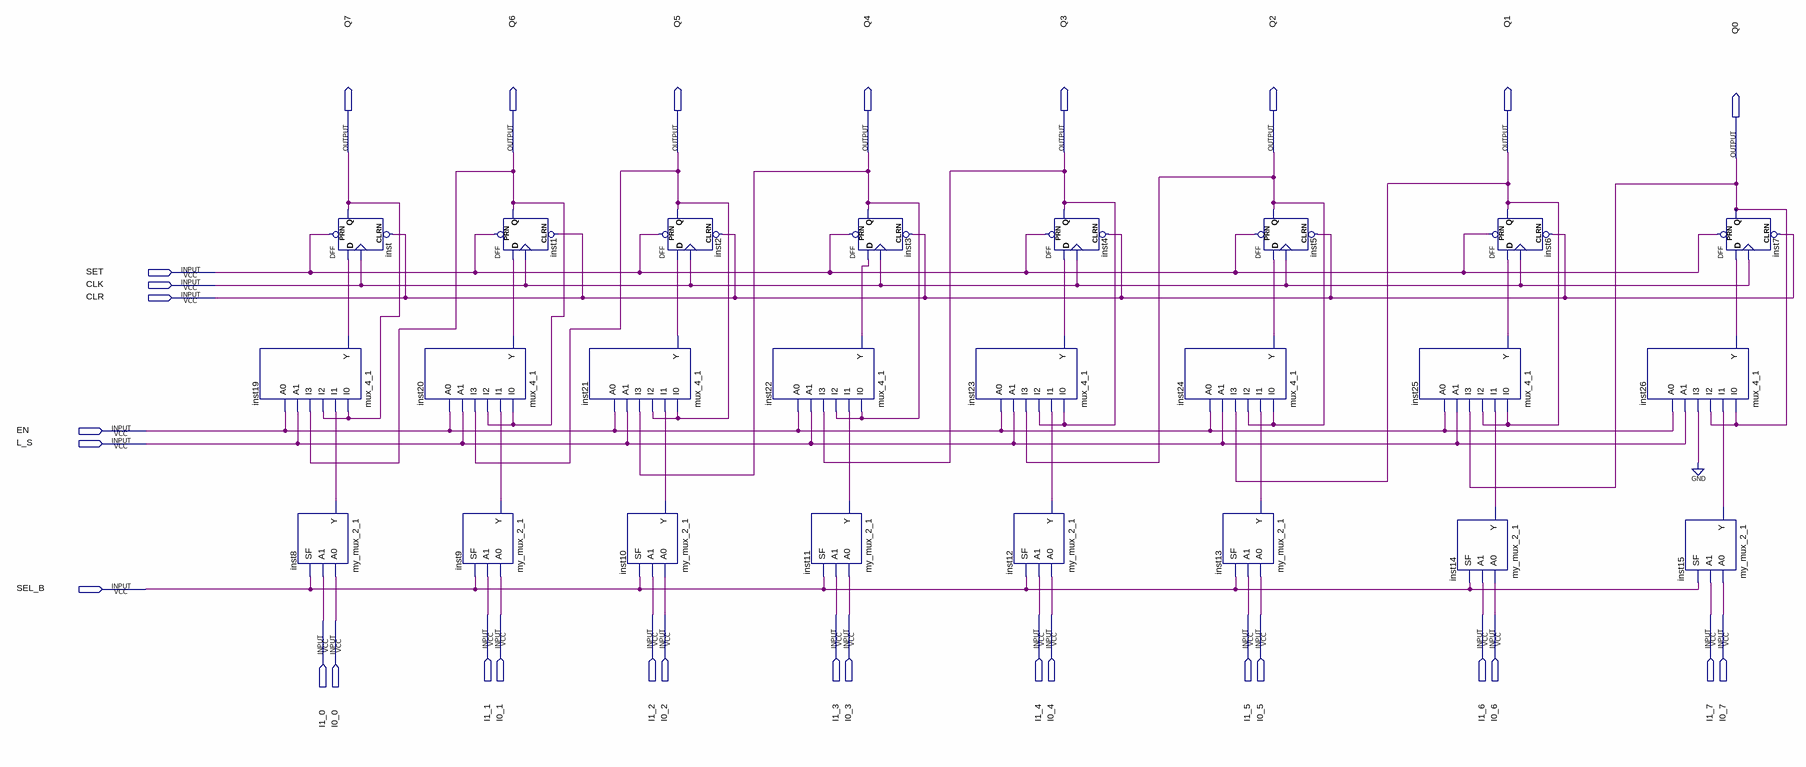
[diagram p0: schematic sheet]
// Quartus schematic REG_B.bdf as structural Verilog: 24 symbols, 30 pins
module REG_B (
  input  SET,
  input  CLK,
  input  CLR,
  input  EN,
  input  L_S,
  input  SEL_B,
  input  I1_1,
  input  I0_1,
  input  I1_2,
  input  I0_2,
  input  I1_3,
  input  I0_3,
  input  I1_4,
  input  I0_4,
  input  I1_5,
  input  I0_5,
  input  I1_6,
  input  I0_6,
  input  I1_7,
  input  I0_7,
  input  I1_0,
  input  I0_0,
  output Q7,
  output Q6,
  output Q5,
  output Q4,
  output Q3,
  output Q2,
  output Q1,
  output Q0
);

  wire inst8_y, inst9_y, inst10_y, inst11_y, inst12_y, inst13_y, inst14_y, inst15_y, inst19_y, inst20_y,
       inst21_y, inst22_y, inst23_y, inst24_y, inst25_y, inst26_y;

  mux_4_1 inst19 (.I0(Q7), .I1(inst8_y), .I2(Q7), .I3(Q6), .A1(L_S), .A0(EN), .Y(inst19_y));
  my_mux_2_1 inst8 (.A0(I0_0), .A1(I1_0), .SF(SEL_B), .Y(inst8_y));
  DFF inst (.CLRN(CLR), .CLK(CLK), .D(inst19_y), .PRN(SET), .Q(Q7));
  mux_4_1 inst20 (.I0(Q6), .I1(inst9_y), .I2(Q6), .I3(Q5), .A1(L_S), .A0(EN), .Y(inst20_y));
  my_mux_2_1 inst9 (.A0(I0_1), .A1(I1_1), .SF(SEL_B), .Y(inst9_y));
  DFF inst1 (.CLRN(CLR), .CLK(CLK), .D(inst20_y), .PRN(SET), .Q(Q6));
  mux_4_1 inst21 (.I0(Q5), .I1(inst10_y), .I2(Q5), .I3(Q4), .A1(L_S), .A0(EN), .Y(inst21_y));
  my_mux_2_1 inst10 (.A0(I0_2), .A1(I1_2), .SF(SEL_B), .Y(inst10_y));
  DFF inst2 (.CLRN(CLR), .CLK(CLK), .D(inst21_y), .PRN(SET), .Q(Q5));
  mux_4_1 inst22 (.I0(Q4), .I1(inst11_y), .I2(Q4), .I3(Q3), .A1(L_S), .A0(EN), .Y(inst22_y));
  my_mux_2_1 inst11 (.A0(I0_3), .A1(I1_3), .SF(SEL_B), .Y(inst11_y));
  DFF inst3 (.CLRN(CLR), .CLK(CLK), .D(inst22_y), .PRN(SET), .Q(Q4));
  mux_4_1 inst23 (.I0(Q3), .I1(inst12_y), .I2(Q3), .I3(Q2), .A1(L_S), .A0(EN), .Y(inst23_y));
  my_mux_2_1 inst12 (.A0(I0_4), .A1(I1_4), .SF(SEL_B), .Y(inst12_y));
  DFF inst4 (.CLRN(CLR), .CLK(CLK), .D(inst23_y), .PRN(SET), .Q(Q3));
  mux_4_1 inst24 (.I0(Q2), .I1(inst13_y), .I2(Q2), .I3(Q1), .A1(L_S), .A0(EN), .Y(inst24_y));
  my_mux_2_1 inst13 (.A0(I0_5), .A1(I1_5), .SF(SEL_B), .Y(inst13_y));
  DFF inst5 (.CLRN(CLR), .CLK(CLK), .D(inst24_y), .PRN(SET), .Q(Q2));
  mux_4_1 inst25 (.I0(Q1), .I1(inst14_y), .I2(Q1), .I3(Q0), .A1(L_S), .A0(EN), .Y(inst25_y));
  my_mux_2_1 inst14 (.A0(I0_6), .A1(I1_6), .SF(SEL_B), .Y(inst14_y));
  DFF inst6 (.CLRN(CLR), .CLK(CLK), .D(inst25_y), .PRN(SET), .Q(Q1));
  mux_4_1 inst26 (.I0(Q0), .I1(inst15_y), .I2(Q0), .I3(1'b0), .A1(L_S), .A0(EN), .Y(inst26_y));
  DFF inst7 (.CLRN(CLR), .CLK(CLK), .D(inst26_y), .PRN(SET), .Q(Q0));
  my_mux_2_1 inst15 (.A0(I0_7), .A1(I1_7), .SF(SEL_B), .Y(inst15_y));
endmodule
